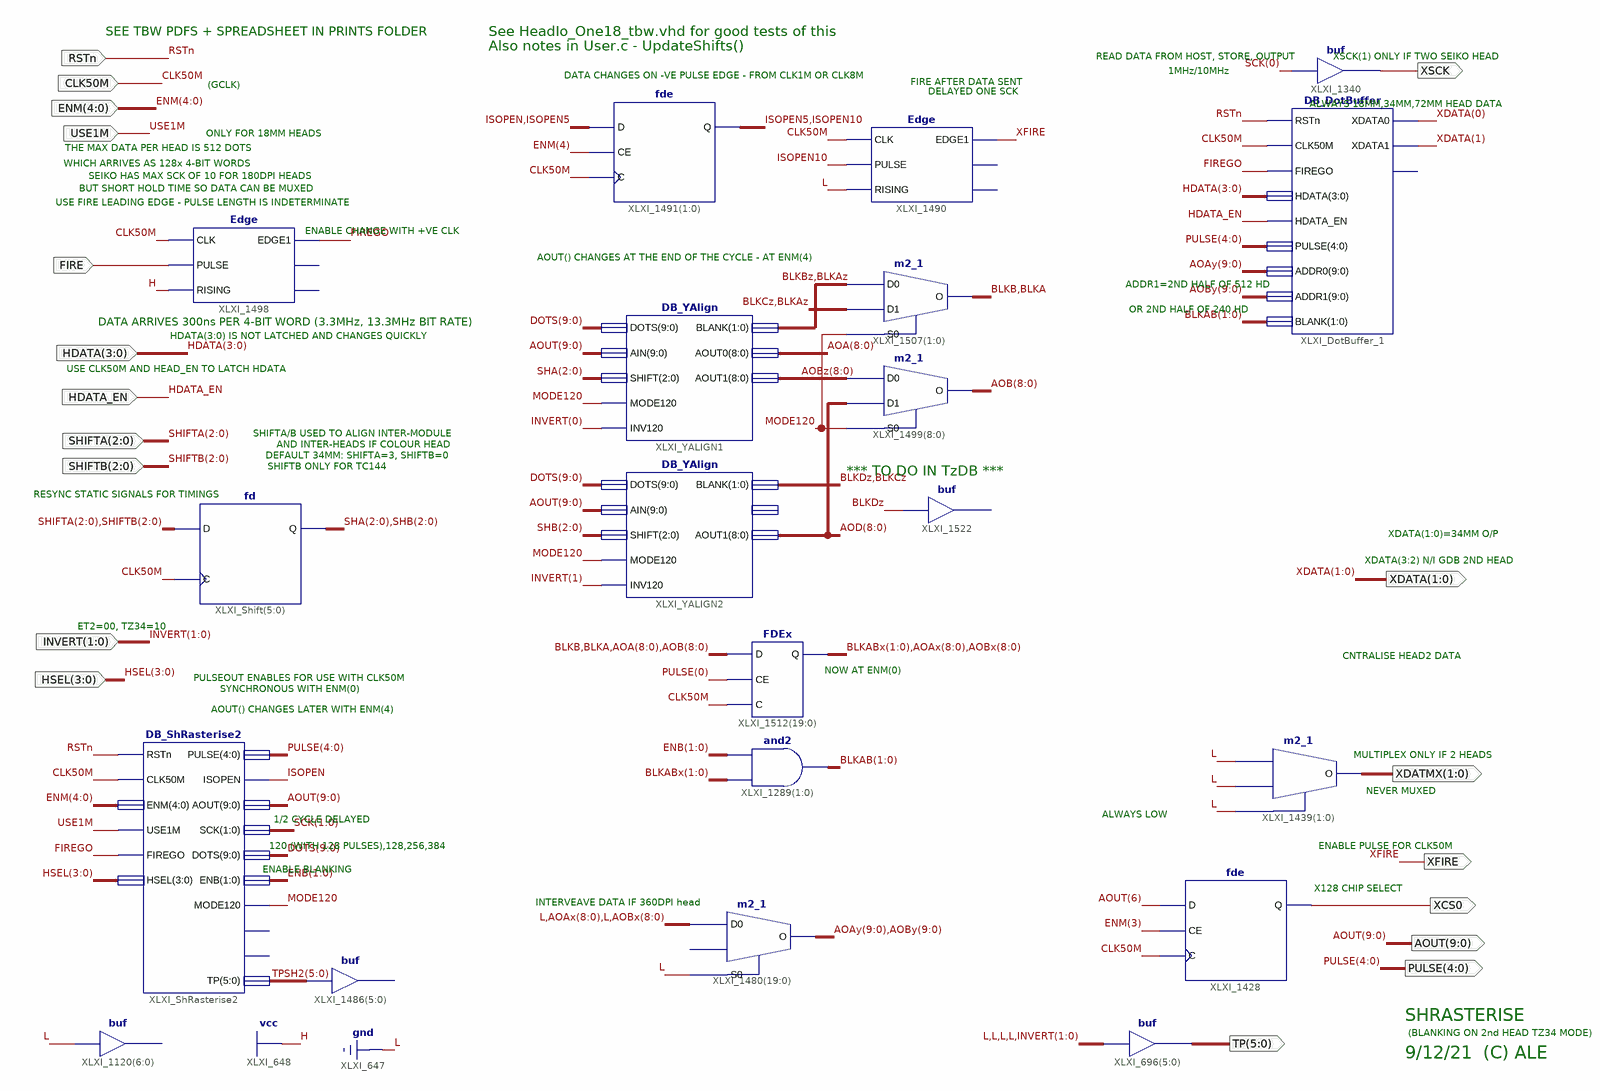
[diagram p0: schematic sheet 1]
// Xilinx ISE schematic DB_ShRasterise.sch (spartan3e) as structural Verilog: 20 symbols, 19 ports
module DB_ShRasterise (
  input  RSTn,
  input  CLK50M,
  input  HDATA_EN,
  input  [3:0] HDATA,
  input  [2:0] SHIFTA,
  input  [2:0] SHIFTB,
  input  [3:0] HSEL,
  input  FIRE,
  input  [4:0] ENM,
  input  USE1M,
  input  [1:0] INVERT,
  output [5:0] TP,
  output XFIRE,
  output [9:0] AOUT,
  output [4:0] PULSE,
  output XSCK,
  output XCS0,
  output [1:0] XDATA,
  output [1:0] XDATMX
);

  wire BLKA, BLKAz, BLKB, BLKBz, BLKCz, BLKDz, FIREGO, ISOPEN, ISOPEN5, ISOPEN10, MODE120;
  wire [1:0] BLKAB, BLKABx, ENB, SCK;
  wire [2:0] SHA, SHB;
  wire [5:0] TPSH2;
  wire [8:0] AOA, AOAx, AOB, AOBx, AOBz, AOD;
  wire [9:0] AOAy, AOBy, DOTS;

  assign TP = {4'b0000, INVERT};  // buf XLXI_696[5..0], 6 bits wide
  // buf XLXI_1120[6..0] has open pins: I=1'b0, O=open
  buf XLXI_1340 (XSCK, SCK[0]);
  fde XLXI_1428 (.C(CLK50M), .CE(ENM[3]), .D(AOUT[6]), .Q(XCS0));
  m2_1 XLXI_1439[1:0] (.D0(1'b0), .D1(1'b0), .S0(1'b0), .O(XDATMX));
  fd XLXI_Shift[5:0] (.C(CLK50M), .D({SHIFTA, SHIFTB}), .Q({SHA, SHB}));
  Edge XLXI_1498 (.CLK(CLK50M), .EDGE1(FIREGO), .PULSE(FIRE), .RISING(1'b1));  // open: EDGE0, EDGEQUICK
  DB_ShRasterise2 XLXI_ShRasterise2 (
    .AOUT(AOUT), .CLK50M(CLK50M), .DOTS(DOTS), .ENB(ENB), .ENM(ENM), .FIREGO(FIREGO), .HSEL(HSEL),
    .ISOPEN(ISOPEN), .MODE120(MODE120), .PULSE(PULSE), .RSTn(RSTn), .SCK(SCK), .TP(TPSH2), .USE1M(USE1M));  // open: ILEAVE, SELHD2
  // buf XLXI_1486[5..0] has open pins: I=TPSH2, O=open
  DB_DotBuffer XLXI_DotBuffer_1 (
    .ADDR0(AOAy), .ADDR1(AOBy), .BLANK(BLKAB), .CLK50M(CLK50M), .FIREGO(FIREGO), .HDATA(HDATA),
    .HDATA_EN(HDATA_EN), .PULSE(PULSE), .RSTn(RSTn), .XDATA0(XDATA[0]), .XDATA1(XDATA[1]));  // open: XCS0
  Edge XLXI_1490 (.CLK(CLK50M), .EDGE1(XFIRE), .PULSE(ISOPEN10), .RISING(1'b0));  // open: EDGE0, EDGEQUICK
  fde XLXI_1491[1:0] (.C(CLK50M), .CE(ENM[4]), .D({ISOPEN, ISOPEN5}), .Q({ISOPEN5, ISOPEN10}));
  m2_1 XLXI_1499[8:0] (.D0(AOBz), .D1(AOD), .S0(MODE120), .O(AOB));
  DB_YAlign XLXI_YALIGN1 (
    .AIN(AOUT), .AOUT0(AOA), .AOUT1(AOBz), .BLANK({BLKBz, BLKAz}), .DOTS(DOTS), .INV120(INVERT[0]),
    .MODE120(MODE120), .SHIFT(SHA));
  DB_YAlign XLXI_YALIGN2 (
    .AIN(AOUT), .AOUT1(AOD), .BLANK({BLKDz, BLKCz}), .DOTS(DOTS), .INV120(INVERT[1]), .MODE120(MODE120),
    .SHIFT(SHB));  // open: AOUT0
  FDEx XLXI_1512[19:0] (.C(CLK50M), .CE(PULSE[0]), .D({BLKB, BLKA, AOA, AOB}), .Q({BLKABx, AOAx, AOBx}));
  m2_1 XLXI_1480[19:0] (.D0({1'b0, AOAx, 1'b0, AOBx}), .S0(1'b0), .O({AOAy, AOBy}));  // open: D1
  assign BLKAB = BLKABx & ENB;  // and2 XLXI_1289[1..0], 2 bits wide
  m2_1 XLXI_1507[1:0] (.D0({BLKBz, BLKAz}), .D1({BLKCz, BLKAz}), .S0(MODE120), .O({BLKB, BLKA}));
  // buf XLXI_1522 has open pins: I=BLKDz, O=open

  // Notes on the sheet:
  //   SEE TBW PDFS + SPREADSHEET IN PRINTS FOLDER
  //   See HeadIo_One18_tbw.vhd for good tests of this
  //   Also notes in User.c - UpdateShifts()
  //   READ DATA FROM HOST, STORE, OUTPUT
  //   XSCK(1) ONLY IF TWO SEIKO HEAD
  //   1MHz/10MHz
  //   DATA CHANGES ON -VE PULSE EDGE - FROM CLK1M OR CLK8M
  //   FIRE AFTER DATA SENT
  //   (GCLK)
  //   DELAYED ONE SCK
  //   ALWAYS 18MM,34MM,72MM HEAD DATA
  //   ONLY FOR 18MM HEADS
  //   THE MAX DATA PER HEAD IS 512 DOTS
  //   WHICH ARRIVES AS 128x 4-BIT WORDS
  //   SEIKO HAS MAX SCK OF 10 FOR 180DPI HEADS
  //   BUT SHORT HOLD TIME SO DATA CAN BE MUXED
  //   USE FIRE LEADING EDGE - PULSE LENGTH IS INDETERMINATE
  //   ENABLE CHANGE WITH +VE CLK
  //   AOUT() CHANGES AT THE END OF THE CYCLE - AT ENM(4)
  //   ADDR1=2ND HALF OF 512 HD
  //   OR 2ND HALF OF 240 HD
  //   DATA ARRIVES 300ns PER 4-BIT WORD (3.3MHz, 13.3MHz BIT RATE)
  //   HDATA(3:0) IS NOT LATCHED AND CHANGES QUICKLY
  //   USE CLK50M AND HEAD_EN TO LATCH HDATA
  //   SHIFTA/B USED TO ALIGN INTER-MODULE
  //   AND INTER-HEADS IF COLOUR HEAD
  //   DEFAULT 34MM: SHIFTA=3, SHIFTB=0
  //   SHIFTB ONLY FOR TC144
  //   *** TO DO IN TzDB ***
  //   RESYNC STATIC SIGNALS FOR TIMINGS
  //   XDATA(1:0)=34MM O/P
  //   XDATA(3:2) N/I GDB 2ND HEAD
  //   ET2=00, TZ34=10
  //   CNTRALISE HEAD2 DATA
  //   NOW AT ENM(0)
  //   PULSEOUT ENABLES FOR USE WITH CLK50M
  //   SYNCHRONOUS WITH ENM(0)
  //   AOUT() CHANGES LATER WITH ENM(4)
  //   MULTIPLEX ONLY IF 2 HEADS
  //   NEVER MUXED
  //   ALWAYS LOW
  //   1/2 CYCLE DELAYED
  //   120 (WITH 128 PULSES),128,256,384
  //   ENABLE PULSE FOR CLK50M
  //   ENABLE BLANKING
  //   X128 CHIP SELECT
  //   INTERVEAVE DATA IF 360DPI head
  //   SHRASTERISE
  //   (BLANKING ON 2nd HEAD TZ34 MODE)
  //   9/12/21  (C) ALE
endmodule
